# Altium project 2003A.PrjPCB
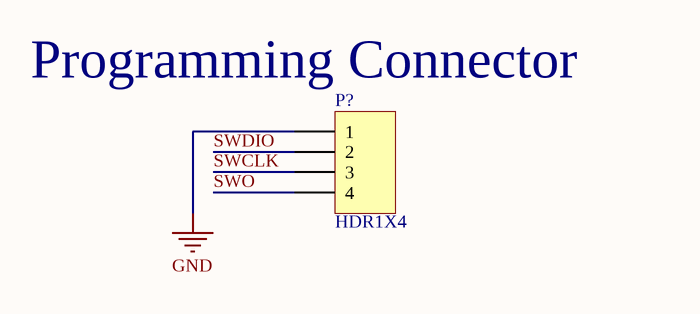
[diagram p0: Programming Connector.SchDoc]
7 sheets, 66 parts. Net scope: flat (ports and power ports of the same name join across sheets).
Sheets:
  Programming Connector.SchDoc
  Torpedo Module Control Connector.SchDoc
  Free Pins Headers.SchDoc
  Ball Gripper's Motor Connector.SchDoc
  Ball Gripper Circuits.SchDoc
  Power Circuits.SchDoc
  MCU.SchDoc

## Sheet Programming Connector.SchDoc
size A4

### Parts
(Parts that share a designator on the sheet are numbered #1, #2 ... from top to bottom, then left to right.)
P?#1  HDR1X4  [Molex SPOX Horizontal 4 Circuits]

### Nets
GND: P?#1.1
SWCLK: P?#1.3
SWDIO: P?#1.2
SWO: P?#1.4

### Notes on the sheet
- (near P?#1) Programming Connector

### Library data of the parts
P?#1 = HDR1X4: Header, 4-Pin; LatestRevisionDate: 17-Jul-2002; LatestRevisionNote: Re-released for DXP Platform.; Publisher: Altium Limited

## Sheet Torpedo Module Control Connector.SchDoc
size A4
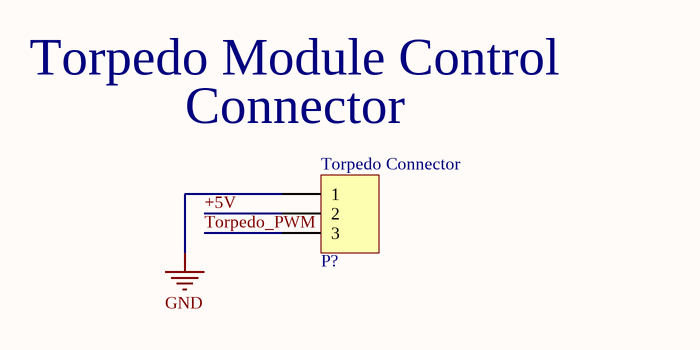
[diagram p1: Torpedo Module Control Connector.SchDoc]

### Parts
(Parts that share a designator on the sheet are numbered #1, #2 ... from top to bottom, then left to right.)
P?#2  HDR1X3  [Molex SPOX Horizontal 3 Circuits]  (value not drawn)

### Nets
GND: P?#2.1
+5V: P?#2.2
Torpedo_PWM: P?#2.3

### Notes on the sheet
- Torpedo Module Control
- (near P?#2) Connector
- (near P?#2) Torpedo Connector

### Library data of the parts
P?#2 = HDR1X3: Header, 3-Pin; LatestRevisionDate: 17-Jul-2002; LatestRevisionNote: Re-released for DXP Platform.; Publisher: Altium Limited

## Sheet Free Pins Headers.SchDoc
size A4
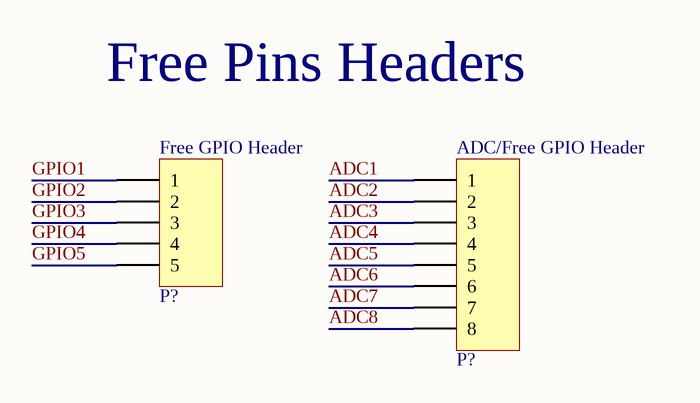
[diagram p2: Free Pins Headers.SchDoc]

### Parts
(Parts that share a designator on the sheet are numbered #1, #2 ... from top to bottom, then left to right.)
P?#3  HDR1X5  [HDR1X5]  (value not drawn)
P?#4  HDR1X8  [HDR1X8]  (value not drawn)

### Nets
ADC1: P?#4.1
ADC2: P?#4.2
ADC3: P?#4.3
ADC4: P?#4.4
ADC5: P?#4.5
ADC6: P?#4.6
ADC7: P?#4.7
ADC8: P?#4.8
GPIO1: P?#3.1
GPIO2: P?#3.2
GPIO3: P?#3.3
GPIO4: P?#3.4
GPIO5: P?#3.5

### Notes on the sheet
- Free Pins Headers
- (near P?#3) Free GPIO Header
- (near P?#4) ADC/Free GPIO Header

### Library data of the parts
P?#3 = HDR1X5: Header, 5-Pin; LatestRevisionDate: 17-Jul-2002; LatestRevisionNote: Re-released for DXP Platform.; Publisher: Altium Limited
P?#4 = HDR1X8: Header, 8-Pin; LatestRevisionDate: 17-Jul-2002; LatestRevisionNote: Re-released for DXP Platform.; Publisher: Altium Limited

## Sheet Ball Gripper's Motor Connector.SchDoc
size A4
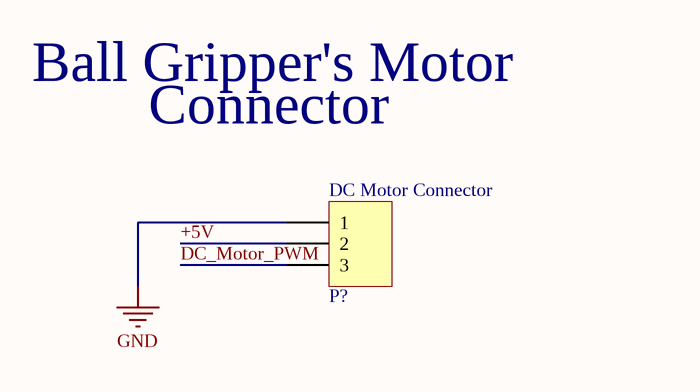
[diagram p3: Ball Gripper's Motor Connector.SchDoc]

### Parts
(Parts that share a designator on the sheet are numbered #1, #2 ... from top to bottom, then left to right.)
P?#5  HDR1X3  [Molex SPOX Horizontal 3 Circuits]  (value not drawn)

### Nets
GND: P?#5.1
+5V: P?#5.2
DC_Motor_PWM: P?#5.3

### Notes on the sheet
- Ball Gripper's Motor
- Connector
- (near P?#5) DC Motor Connector

### Library data of the parts
P?#5 = HDR1X3: Header, 3-Pin; LatestRevisionDate: 17-Jul-2002; LatestRevisionNote: Re-released for DXP Platform.; Publisher: Altium Limited

## Sheet Ball Gripper Circuits.SchDoc
size A4
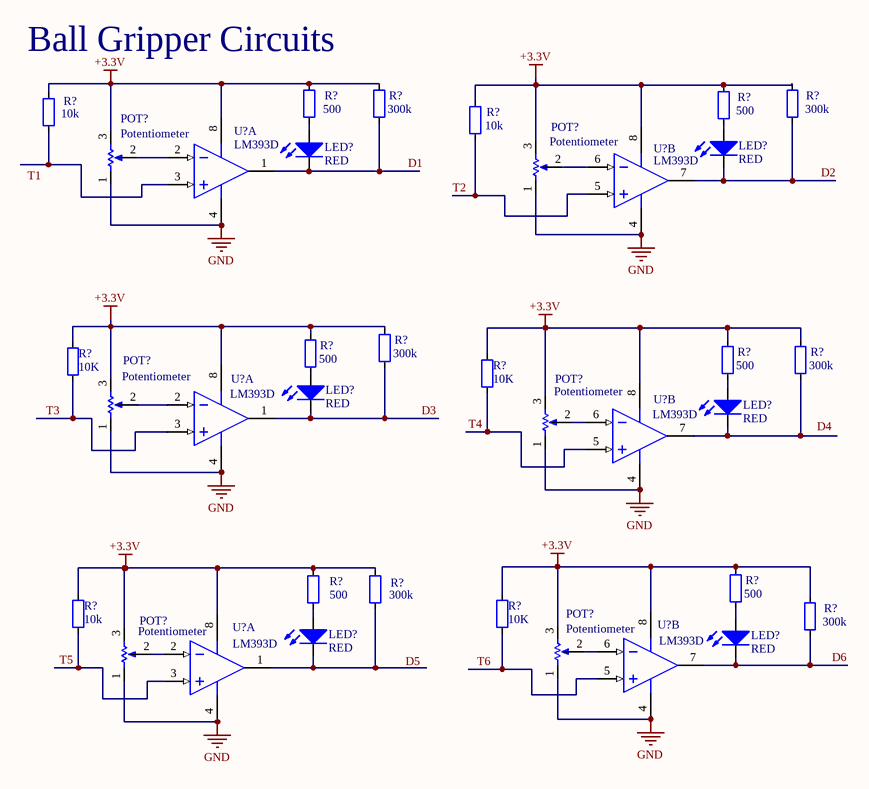
[diagram p4: Ball Gripper Circuits.SchDoc]

### Parts
(Parts that share a designator on the sheet are numbered #1, #2 ... from top to bottom, then left to right.)
LED?#1  RED  [0603_led_red]
LED?#2  RED  [0603_led_red]
LED?#3  RED  [0603_led_red]
LED?#4  RED  [0603_led_red]
LED?#5  RED  [0603_led_red]
LED?#6  RED  [0603_led_red]
POT?#1  Potentiometer  [Pot_3296]
POT?#2  Potentiometer  [Pot_3296]
POT?#3  Potentiometer  [Pot_3296]
POT?#4  Potentiometer  [Pot_3296]
POT?#5  Potentiometer  [Pot_3296]
POT?#6  Potentiometer  [Pot_3296]
R?#1  500  [0603]
R?#2  300k  [0603]
R?#3  500  [0603]
R?#4  300k  [0603]
R?#5  10k  [0603]
R?#6  10k  [0603]
R?#7  300k  [0603]
R?#8  500  [0603]
R?#9  10K  [0603]
R?#10  500  [0603]
R?#11  300k  [0603]
R?#12  10K  [0603]
R?#13  500  [0603]
R?#14  300k  [0603]
R?#15  500  [0603]
R?#16  10k  [0603]
R?#17  10K  [0603]
R?#18  300k  [0603]
U?#1  LM393D  [SO8_N]  (part A of 2)
U?#2  LM393D  [SO8_N]  (part B of 2)
U?#3  LM393D  [SO8_N]  (part A of 2)
U?#4  LM393D  [SO8_N]  (part B of 2)
U?#5  LM393D  [SO8_N]  (part A of 2)
U?#6  LM393D  [SO8_N]  (part B of 2)

### Nets
+3.3V: POT?#1.3 POT?#2.3 POT?#3.3 POT?#4.3 POT?#5.3 POT?#6.3 R?#1.2 R?#2.2 R?#3.2 R?#4.2 R?#5.2 R?#6.2 R?#7.2 R?#8.2 R?#9.2 R?#10.2 R?#11.2 R?#12.2 R?#13.2 R?#14.2 R?#15.2 R?#16.2 R?#17.2 R?#18.2 U?#1.8(V+) U?#2.8(V+) U?#3.8(V+) U?#4.8(V+) U?#5.8(V+) U?#6.8(V+)
GND: POT?#1.1 POT?#2.1 POT?#3.1 POT?#4.1 POT?#5.1 POT?#6.1 U?#1.4(V-) U?#2.4(V-) U?#3.4(V-) U?#4.4(V-) U?#5.4(V-) U?#6.4(V-)
D1: LED?#2.2(K) R?#2.1 U?#1.1(OUT)
D2: LED?#1.2(K) R?#4.1 U?#2.7(OUT)
D3: LED?#3.2(K) R?#7.1 U?#3.1(OUT)
D6: LED?#6.2(K) R?#18.1 U?#6.7(OUT)
T2: R?#6.1 U?#2.5(IN+)
T3: R?#9.1 U?#3.3(IN+)
T4: R?#12.1 U?#4.5(IN+)
T5: R?#16.1 U?#5.3(IN+)
T6: R?#17.1 U?#6.5(IN+)
NetLED?#1_1: LED?#1.1(A) R?#3.1
NetLED?#2_1: LED?#2.1(A) R?#1.1
NetLED?#3_1: LED?#3.1(A) R?#8.1
NetLED?#4_1: LED?#4.1(A) R?#10.1
NetLED?#4_2: LED?#4.2(K) R?#11.1 U?#4.7(OUT)
NetLED?#5_1: LED?#5.1(A) R?#13.1
NetLED?#5_2: LED?#5.2(K) R?#14.1 U?#5.1(OUT)
NetLED?#6_1: LED?#6.1(A) R?#15.1
NetPOT?#1_2: POT?#1.2 U?#1.2(IN-)
NetPOT?#2_2: POT?#2.2 U?#2.6(IN-)
NetPOT?#3_2: POT?#3.2 U?#3.2(IN-)
NetPOT?#4_2: POT?#4.2 U?#4.6(IN-)
NetPOT?#5_2: POT?#5.2 U?#5.2(IN-)
NetPOT?#6_2: POT?#6.2 U?#6.6(IN-)
NetR?#5_1: R?#5.1 U?#1.3(IN+)

### Notes on the sheet
- (near R?#2) Ball Gripper Circuits
- Labels drawn without touching a wire or pin: D4, D5, T1

### Library data of the parts
LED?#1-LED?#6 = LED: Light-emitting diode; COLOR: RED
R?#1-R?#18 = RES: Resistior
  R?#1 R?#3 R?#8 R?#10 R?#13 R?#15: Value: 500
  R?#2 R?#4 R?#7 R?#11 R?#14 R?#18: Value: 300k
  R?#5 R?#6 R?#16: Value: 10k
  R?#9 R?#12 R?#17: Value: 10K
U?#1-U?#6 = LM393D: Low-Power Dual Voltage Comparator; Published: 24-Aug-2001; LatestRevisionDate: 13-Apr-2006; LatestRevisionNote: IPC-7351 Footprint Added.; DatasheetVersion: Jun-1998; PackageVersion: Dec-2002; PackageReference: SO8; Publisher: Altium Limited; PackageDescription: 8-Pin Small Outline Integrated Circuit 1.27 mm Pitch; Code_JEDEC: MS-012-AA; Code_IPC: SOIC127P600-8; ComponentLink1Description: Manufacturer Link; ComponentLink1URL: http://www.st.com/; ComponentLink2Description: Datasheet; ComponentLink2URL: http://www.st.com/stonline/products/literature/ds/2164/lm293.pdf

## Sheet Power Circuits.SchDoc
size A4
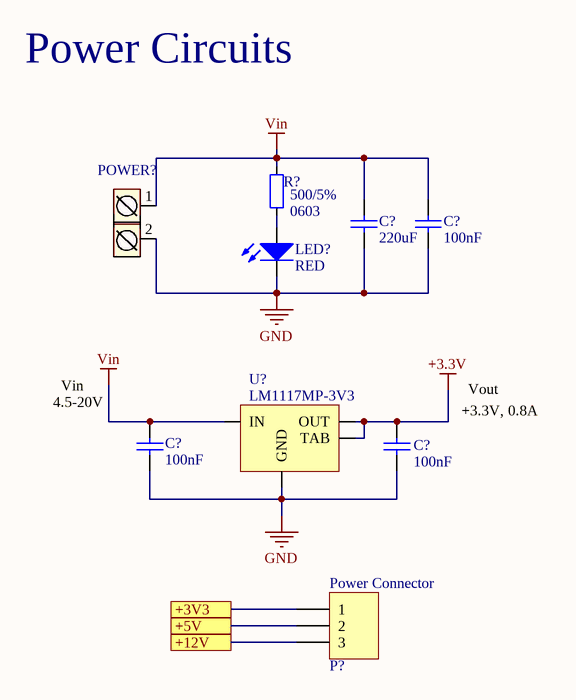
[diagram p5: Power Circuits.SchDoc]

### Parts
(Parts that share a designator on the sheet are numbered #1, #2 ... from top to bottom, then left to right.)
C?#1  value 220uF  [0603_CAP]  (hidden comment: Cap)
C?#2  value 100nF  [0603_CAP]  (hidden comment: Cap)
C?#3  value 100nF  [0603_CAP]  (hidden comment: Cap)
C?#4  value 100nF  [0603_CAP]  (hidden comment: Cap)
LED?#7  RED  [0603_led_red]
P?#6  HDR1X3  [Molex SPOX Horizontal 3 Circuits]  (value not drawn)
POWER?  ARK2  [ARK2]  (value not drawn)
R?#19  500/5%  [0603]
U?#7  LM1117MP-3V3  [SOT223]

### Ports
+3V3, +5V, +12V

### Nets
+3.3V: C?#4.1 U?#7.2(OUT) U?#7.4(TAB)
GND: C?#1.1 C?#2.1 C?#3.2 C?#4.2 LED?#7.2(K) POWER?.2 U?#7.1(GND)
Vin: C?#1.2 C?#2.2 C?#3.1 POWER?.1 R?#19.2 U?#7.3(IN)
NetLED?#7_1: LED?#7.1(A) R?#19.1
NetP?#6_1: P?#6.1 ; port +3V3
NetP?#6_2: P?#6.2 ; port +5V
NetP?#6_3: P?#6.3 ; port +12V

### Notes on the sheet
- Power Circuits
- (near C?#3) 4.5-20V
- Vin
- +3.3V, 0.8A
- Vout
- (near P?#6) Power Connector

### Library data of the parts
C?#1-C?#4 = Cap: Ceramic capacitor; Unit Price1: *; Unit Price2: *
LED?#7 = LED: Light-emitting diode; COLOR: RED
P?#6 = HDR1X3: Header, 3-Pin; LatestRevisionDate: 17-Jul-2002; LatestRevisionNote: Re-released for DXP Platform.; Publisher: Altium Limited
POWER? = ARK2: Złącze śrubowe 2 piny
R?#19 = RES: Resistior; Value: 500/5%; Package: 0603
U?#7 = LM1117MP-3V3: 800mA Low-Dropout Linear Regulator; PartNumber: LM1117MP-3.3; Manufacturer: National Semiconductor; CompType: LDO IC; PackageTopMarking: XYTT*N05A; PowerWise: N; DatasheetVersion: Apr-2006; PackageVersion: revB, Apr-2003; PackageReference: MP04A; PackageDescription: Molded SOT-223, 6.50 x 3.56 x 1.6mm Body, 4 Lead, 2.3mm Pitch; ComponentLink1Description: LM1117 Datasheet; ComponentLink1URL: http://www.national.com/ds/LM/LM1117.pdf; ComponentLink2Description: LM1117 Web Page; ComponentLink2URL: http://www.national.com/pf/LM/LM1117.html; Published: 4-Dec-2008; Publisher: Altium Limited; RoHS: O; PinCount: 4; DigiKeyPartNumber: LM1117MP-3.3CT-ND; Code_JEDEC: TO-261-AA; Code_IPC: SOT223-4; ComponentLink3Description: MP04A Package Page; ComponentLink3URL: http://www.national.com/packaging/folders/mp04a.html

## Sheet MCU.SchDoc
size A4
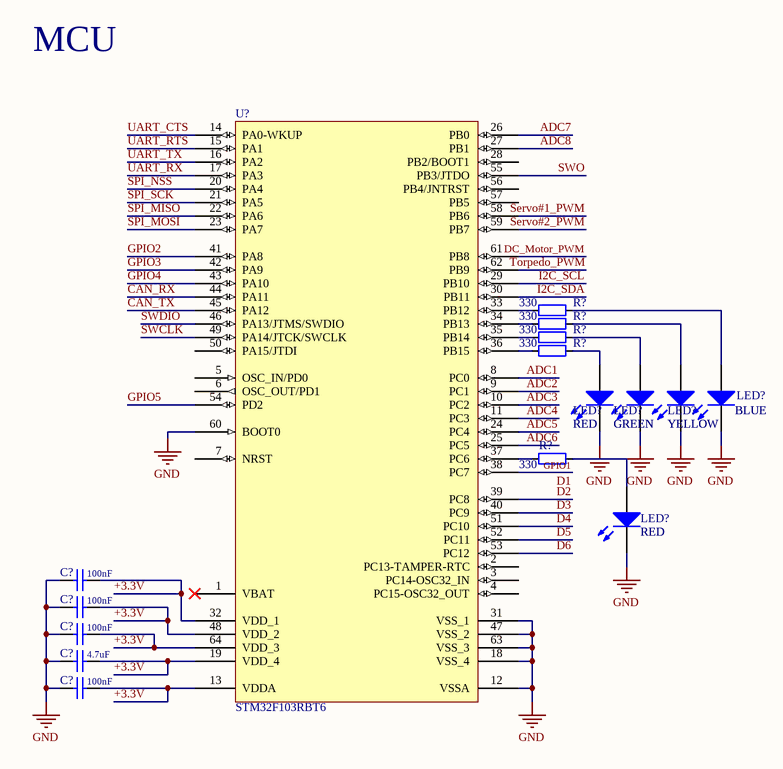
[diagram p6: MCU.SchDoc]

### Parts
(Parts that share a designator on the sheet are numbered #1, #2 ... from top to bottom, then left to right.)
C?#5  value 100nF  [0603_CAP]  (hidden comment: Cap)
C?#6  value 100nF  [0603_CAP]  (hidden comment: Cap)
C?#7  value 100nF  [0603_CAP]  (hidden comment: Cap)
C?#8  value 4.7uF  [0603_CAP]  (hidden comment: Cap)
C?#9  value 100nF  [0603_CAP]  (hidden comment: Cap)
LED?#8  RED  [LED_THT_RED]
LED?#9  GREEN  [LED_THT_YELLOW]
LED?#10  YELLOW  [LED_THT_GREEN]
LED?#11  BLUE  [LED_THT_BLUE]
LED?#12  RED  [LED_THT_RED]
R?#20  330  [0603]
R?#21  330  [0603]
R?#22  330  [0603]
R?#23  330  [0603]
R?#24  330  [0603]
U?#8  STM32F103RBT6  [LQFP64_L]

### Nets
GND: C?#5.1 C?#6.1 C?#7.1 C?#8.1 C?#9.1 LED?#8.2(K) LED?#9.2(K) LED?#10.2(K) LED?#11.2(K) LED?#12.2(K) U?#8.12(VSSA) U?#8.18(VSS_4) U?#8.31(VSS_1) U?#8.47(VSS_2) U?#8.60(BOOT0) U?#8.63(VSS_3)
+3.3V: C?#5.2 C?#6.2 C?#7.2 C?#8.2 C?#9.2 U?#8.13(VDDA) U?#8.19(VDD_4) U?#8.32(VDD_1) U?#8.48(VDD_2) U?#8.64(VDD_3)
ADC1: U?#8.8(PC0)
ADC2: U?#8.9(PC1)
ADC3: U?#8.10(PC2)
ADC4: U?#8.11(PC3)
ADC5: U?#8.24(PC4)
ADC6: U?#8.25(PC5)
ADC7: U?#8.26(PB0)
ADC8: U?#8.27(PB1)
CAN_RX: U?#8.44(PA11)
CAN_TX: U?#8.45(PA12)
D1: U?#8.38(PC7)  [also labelled GPIO1]
D2: U?#8.39(PC8)
D3: U?#8.40(PC9)
D4: U?#8.51(PC10)
D5: U?#8.52(PC11)
D6: U?#8.53(PC12)
DC_Motor_PWM: U?#8.61(PB8)
GPIO2: U?#8.41(PA8)
GPIO3: U?#8.42(PA9)
GPIO4: U?#8.43(PA10)
GPIO5: U?#8.54(PD2)
I2C_SCL: U?#8.29(PB10)
I2C_SDA: U?#8.30(PB11)
Servo#1_PWM: U?#8.58(PB6)
Servo#2_PWM: U?#8.59(PB7)
SPI_MISO: U?#8.22(PA6)
SPI_MOSI: U?#8.23(PA7)
SPI_NSS: U?#8.20(PA4)
SPI_SCK: U?#8.21(PA5)
SWCLK: U?#8.49(PA14/JTCK/SWCLK)
SWDIO: U?#8.46(PA13/JTMS/SWDIO)
SWO: U?#8.55(PB3/JTDO)
Torpedo_PWM: U?#8.62(PB9)
UART_CTS: U?#8.14(PA0-WKUP)
UART_RTS: U?#8.15(PA1)
UART_RX: U?#8.17(PA3)
UART_TX: U?#8.16(PA2)
NetLED?#8_1: LED?#8.1(A) R?#23.2
NetLED?#9_1: LED?#9.1(A) R?#22.2
NetLED?#10_1: LED?#10.1(A) R?#21.2
NetLED?#11_1: LED?#11.1(A) R?#20.2
NetLED?#12_1: LED?#12.1(A) R?#24.2
NetR?#20_1: R?#20.1 U?#8.33(PB12)
NetR?#21_1: R?#21.1 U?#8.34(PB13)
NetR?#22_1: R?#22.1 U?#8.35(PB14)
NetR?#23_1: R?#23.1 U?#8.36(PB15)
NetR?#24_1: R?#24.1 U?#8.37(PC6)

Not connected (* = marked no-connect by the designer): U?#8 1(VBAT)* 2(PC13-TAMPER-RTC) 3(PC14-OSC32_IN) 4(PC15-OSC32_OUT) 5(OSC_IN/PD0) 6(OSC_OUT/PD1) 7(NRST) 28(PB2/BOOT1) 50(PA15/JTDI) 56(PB4/JNTRST) 57(PB5)

### Notes on the sheet
- MCU

### Library data of the parts
C?#5-C?#9 = Cap: Ceramic capacitor; Unit Price1: *; Unit Price2: *
LED?#8-LED?#12 = LED: Light-emitting diode
  LED?#8 LED?#12: COLOR: RED
  LED?#9: COLOR: GREEN
  LED?#10: COLOR: YELLOW
  LED?#11: COLOR: BLUE
R?#20-R?#24 = RES: Resistior; Value: 330
U?#8 = STM32F103RBT6: STM32 ARM-based 32-bit; Published: 30-May-2008; DatasheetVersion: rev6, Mar-2008; PackageVersion: Mar-2008; PackageReference: LQFP64; Publisher: Altium Limited; PackageDescription: 64-Pin Low-Profile Quad Flat Pack, 10 x 10 mm Body, 0.5 mm Pitch (LQFP64); ComponentLink1Description: Manufacturer Link; ComponentLink1URL: www.st.com/stm32; ComponentLink2Description: Datasheet; ComponentLink2URL: http://www.st.com/stonline/products/literature/ds/13587.pdf

## Nets that join several sheets
+3.3V: Ball Gripper Circuits (30 pins), Power Circuits (C?#4.1 U?#7.2 U?#7.4)
GND: Programming Connector (P?#1.1), Torpedo Module Control Connector (P?#2.1), Ball Gripper's Motor Connector (P?#5.1), Ball Gripper Circuits (12 pins), Power Circuits (7 pins), MCU (16 pins)